# Altium schematic sheet PWM_cylinder.SchDoc
size A4
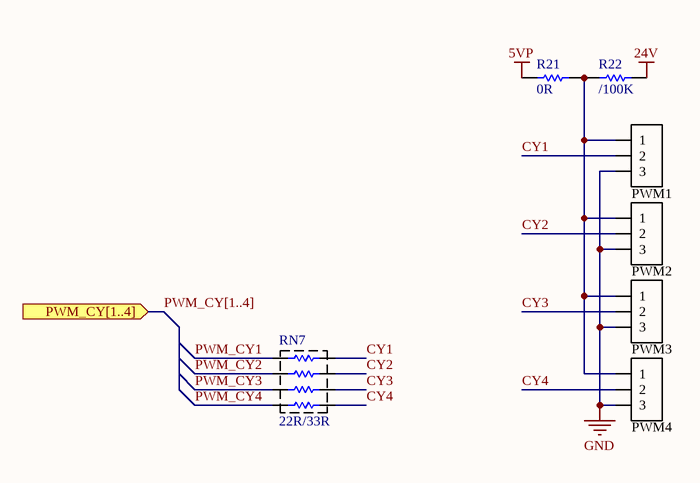
[diagram p0: PWM_cylinder.SchDoc]

## Parts
PWM1  Header  [1x3POS_HEADER]  (value not drawn)
PWM2  Header  [1x3POS_HEADER]  (value not drawn)
PWM3  Header  [1x3POS_HEADER]  (value not drawn)
PWM4  Header  [1x3POS_HEADER]  (value not drawn)
R21  value 0R  [RESC1608X55N]  (hidden comment: Res1)
R22  value /100K  [RESC1608X55N]  (hidden comment: Res1)
RN7  value 22R/33R  [RESCAXS50P160X320X70-8N]  (hidden comment: resistor network)

## Ports
PWM_CY[1..4] (in)

## Nets
5VP: R21.2
24V: R22.1
GND: PWM1.3 PWM2.3 PWM3.3 PWM4.3
CY1: PWM1.2 RN7.8
CY2: PWM2.2 RN7.7
CY3: PWM3.2 RN7.6
CY4: PWM4.2 RN7.5
PWM_CY1: RN7.1
PWM_CY2: RN7.2
PWM_CY3: RN7.3
PWM_CY4: RN7.4
NetPWM1_1: PWM1.1 PWM2.1 PWM3.1 PWM4.1 R21.1 R22.2

## Buses and harness runs
bus PWM_CY[1..4] = port PWM_CY[1..4]

## Library data of the parts
PWM1-PWM4 = Header3P: Header 3-pin
R21 R22 = Res1: Resistor; Published: 8-Jun-2000; LatestRevisionDate: 17-Jul-2002; LatestRevisionNote: Re-released for DXP Platform.; PackageReference: AXIAL-0.3; Publisher: Altium Limited; PackageDescription: Axial Device, Thru-Hole; 2 Leads; 0.3 in Pin Spacing
RN7 = RES_NET